# EAGLE schematic whoop-v0.11td (EAGLE 6.4)
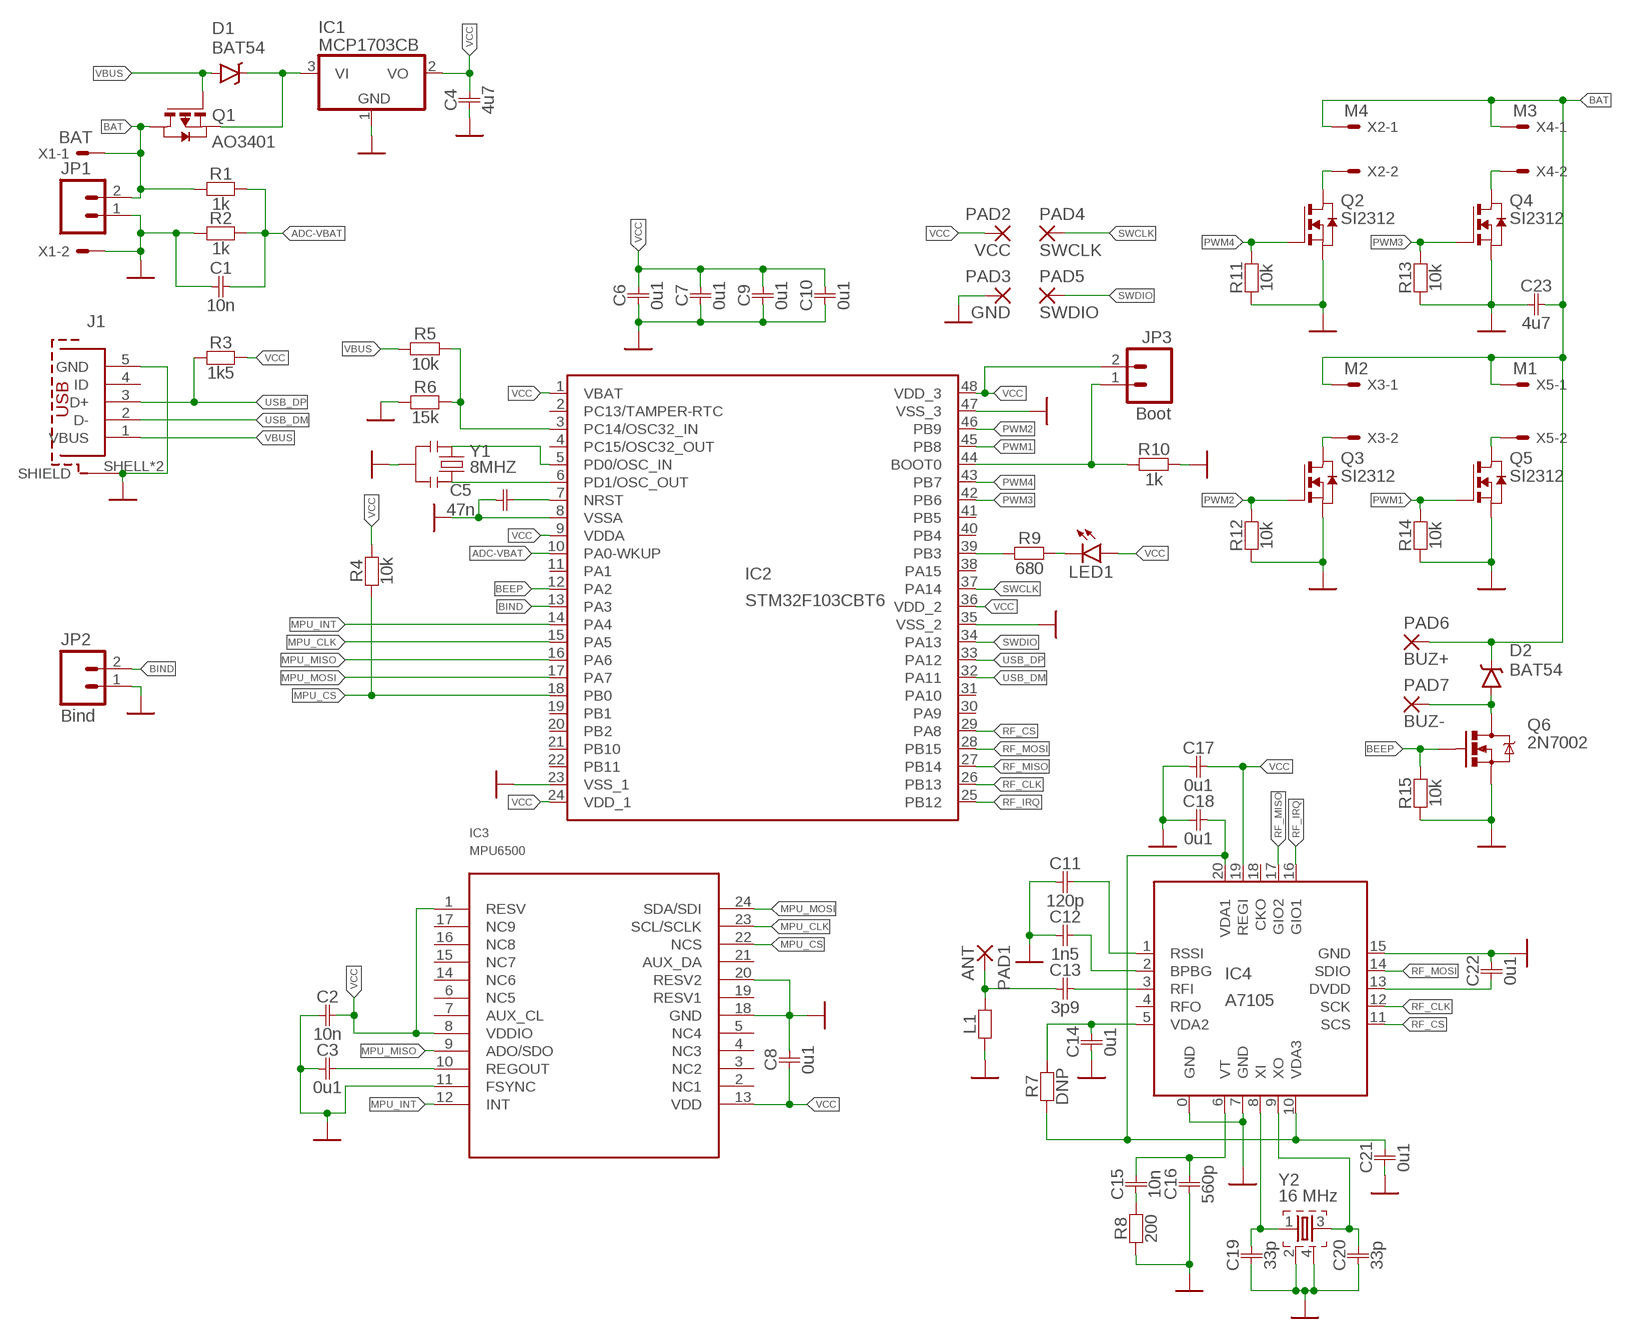
[diagram p0: schematic, sheet 1]

## Parts
C1  10n  C0402  [0402]
C2  10n  C0402  [0402]
C3  0u1  C0402  [0402]
C4  4u7  C0805  [0805]
C5  47n  C0402  [0402]
C6  0u1  C0402  [0402]
C7  0u1  C0402  [0402]
C8  0u1  C0402  [0402]
C9  0u1  C0402  [0402]
C10  0u1  C0402  [0402]
C11  120p  C0402  [0402]
C12  1n5  C0402  [0402]
C13  3p9  C0402  [0402]
C14  0u1  C0402  [0402]
C15  10n  C0402  [0402]
C16  560p  C0402  [0402]
C17  0u1  C0402  [0402]
C18  0u1  C0402  [0402]
C19  33p  C0402  [0402]
C20  33p  C0402  [0402]
C21  0u1  C0402  [0402]
C22  0u1  C0402  [0402]
C23  4u7  C0805  [0805]
D1  BAT54  BAT20JFILM  [SOD-323]
D2  BAT54  BAT20JFILM  [SOD-323]
IC1  MCP1703CB  [SOT23]
IC2  STM32F103CBT6  STM32F103C8  [LQFP48]
IC3  MPU6500  MPU-9250  [LEAD-QFN24]
IC4  A7105  [QFN20]
J1  614105150721  [614105150721]
JP1  M022MM  [1X02_2MM]
JP2  Bind  M021.27MM  [1X02_1.27MM]
JP3  Boot  M021.27MM  [1X02_1.27MM]
L1  R0402  [0402]
LED1  LED-RED0603  [LED-0603]
PAD1  ANT  1,6/0,8  [1,6/0,8]
PAD2  VCC  SMD2  [SMD1,27-2,54]
PAD3  GND  SMD2  [SMD1,27-2,54]
PAD4  SWCLK  SMD2  [SMD1,27-2,54]
PAD5  SWDIO  SMD2  [SMD1,27-2,54]
PAD6  BUZ+  SMD2  [SMD1,27-2,54]
PAD7  BUZ-  SMD2  [SMD1,27-2,54]
Q1  AO3401  PMOSSOT23  [SOT-23]
Q2  SI2312  NMOSSOT23  [SOT-23]
Q3  SI2312  NMOSSOT23  [SOT-23]
Q4  SI2312  NMOSSOT23  [SOT-23]
Q5  SI2312  NMOSSOT23  [SOT-23]
Q6  2N7002  MOSFET-NCHANNEL2N7002PW  [SOT323]
R1  1k  R0402  [0402]
R2  1k  R0402  [0402]
R3  1k5  R0402  [0402]
R4  10k  R0402  [0402]
R5  10k  R0402  [0402]
R6  15k  R0402  [0402]
R7  DNP  R0402  [0402]
R8  200  R0402  [0402]
R9  680  R0402  [0402]
R10  1k  R0402  [0402]
R11  10k  R0402  [0402]
R12  10k  R0402  [0402]
R13  10k  R0402  [0402]
R14  10k  R0402  [0402]
R15  10k  R0402  [0402]
X1  BAT  53047-02  [53047-02]
X2  M4  53047-02  [53047-02]
X3  M2  53047-02  [53047-02]
X4  M3  53047-02  [53047-02]
X5  M1  53047-02  [53047-02]
Y1  8MHZ  RESONATOR8MHZ  [RESONATOR-SMD]
Y2  16 MHz  FA-3225  [FA-20H]

## Nets
ADC-VBAT: C1.P$2 IC2.10(PA0-WKUP) R1.P$1 R2.P$1
BAT: C23.P$2 D2.C JP1.2 PAD6.1(P) Q1.1(D) R1.P$2 X1.1 X2.1 X3.1 X4.1 X5.1
BEEP: IC2.12(PA2) Q6.1(G) R15.P$2
BIND: IC2.13(PA3) JP2.2
GND: C1.P$1 C2.P$1 C3.P$1 C4.P$1 C5.P$1 C6.P$1 C7.P$1 C8.P$2 C9.P$1 C10.P$1 C11.P$1 C12.P$1 C14.P$1 C16.P$1 C17.P$1 C18.P$1 C19.P$1 C20.P$1 C21.P$1 C22.P$2 C23.P$1 IC1.1(GND) IC2.8(VSSA) IC2.23(VSS_1) IC2.35(VSS_2) IC2.47(VSS_3) IC3.11(FSYNC) IC3.18(GND) IC3.20(RESV2) IC4.0(GND) IC4.7(GND) IC4.15(GND) J1.5(GND) J1.SHELL1(SHIELD) J1.SHELL(SHIELD) JP1.1 JP2.1 L1.P$1 PAD3.1(P) Q2.2(S) Q3.2(S) Q4.2(S) Q5.2(S) Q6.2(S) R2.P$2 R6.P$2 R8.P$1 R10.P$2 R11.P$1 R12.P$1 R13.P$1 R14.P$1 R15.P$1 X1.2 Y1.2 Y2.2 Y2.4
M1+: Q2.1(D) X2.2
M2+: Q4.1(D) X4.2
M3+: Q3.1(D) X3.2
M4+: Q5.1(D) X5.2
MPU_CLK: IC2.15(PA5) IC3.23(SCL/SCLK)
MPU_CS: IC2.18(PB0) IC3.22(NCS) R4.P$1
MPU_INT: IC2.14(PA4) IC3.12(INT)
MPU_MISO: IC2.16(PA6) IC3.9(ADO/SDO)
MPU_MOSI: IC2.17(PA7) IC3.24(SDA/SDI)
N$1: C13.P$2 IC4.3(RFI)
N$2: D2.A PAD7.1(P) Q6.3(D)
N$3: C3.P$2 IC3.10(REGOUT)
N$4: C13.P$1 L1.P$2 PAD1.1(P)
N$5: C19.P$2 IC4.8(XI) Y2.1
N$6: C20.P$2 IC4.9(XO) Y2.3
N$7: C12.P$2 IC4.2(BPBG)
N$8: C11.P$2 IC4.1(RSSI)
N$9: C15.P$2 C16.P$2 IC4.6(VT)
N$10: C22.P$1 IC4.13(DVDD)
N$11: C15.P$1 R8.P$2
N$12: C18.P$2 C21.P$2 IC4.10(VDA3) IC4.20(VDA1) R7.P$1
N$13: IC2.6(PD1/OSC_OUT) Y1.3
N$14: C14.P$2 IC4.5(VDA2) R7.P$2
N$15: LED1.C R9.P$2
N$16: IC2.39(PB3) R9.P$1
N$17: IC2.3(PC14/OSC32_IN) R5.P$2 R6.P$1
N$19: IC2.44(BOOT0) JP3.1 R10.P$1
N$33: IC2.5(PD0/OSC_IN) Y1.1
N$36: D1.C IC1.3(VI) Q1.2(S)
N$37: C5.P$2 IC2.7(NRST)
PWM1: IC2.45(PB8) Q5.3(G) R14.P$2
PWM2: IC2.46(PB9) Q3.3(G) R12.P$2
PWM3: IC2.42(PB6) Q4.3(G) R13.P$2
PWM4: IC2.43(PB7) Q2.3(G) R11.P$2
RF_CLK: IC2.26(PB13) IC4.12(SCK)
RF_CS: IC2.29(PA8) IC4.11(SCS)
RF_IRQ: IC2.25(PB12) IC4.16(GIO1)
RF_MISO: IC2.27(PB14) IC4.17(GIO2)
RF_MOSI: IC2.28(PB15) IC4.14(SDIO)
SWCLK: IC2.37(PA14) PAD4.1(P)
SWDIO: IC2.34(PA13) PAD5.1(P)
USB_DM: IC2.32(PA11) J1.2(D-)
USB_DP: IC2.33(PA12) J1.3(D+) R3.P$2
VBUS: D1.A J1.1(VBUS) Q1.3(G) R5.P$1
VCC: C2.P$2 C4.P$2 C6.P$2 C7.P$2 C8.P$1 C9.P$2 C10.P$2 C17.P$2 IC1.2(VO) IC2.1(VBAT) IC2.9(VDDA) IC2.24(VDD_1) IC2.36(VDD_2) IC2.48(VDD_3) IC3.1(RESV) IC3.8(VDDIO) IC3.13(VDD) IC4.19(REGI) JP3.2 LED1.A PAD2.1(P) R3.P$1 R4.P$2
Unconnected: IC2.2(PC13/TAMPER-RTC) IC2.4(PC15/OSC32_OUT) IC2.11(PA1) IC2.19(PB1) IC2.20(PB2) IC2.21(PB10) IC2.22(PB11) IC2.30(PA9) IC2.31(PA10) IC2.38(PA15) IC2.40(PB4) IC2.41(PB5) IC3.2(NC1) IC3.3(NC2) IC3.4(NC3) IC3.5(NC4) IC3.6(NC5) IC3.7(AUX_CL) IC3.14(NC6) IC3.15(NC7) IC3.16(NC8) IC3.17(NC9) IC3.19(RESV1) IC3.21(AUX_DA) IC4.4(RFO) IC4.18(CKO) J1.4(ID)

## Library data of the parts
C1-C23 = RC.v2:C
D1 D2 = SparkFun-DiscreteSemi:BAT20JFILM: 23V, 1A Schottky diode, SOD-323 package; PROD_ID: DIO-11623; VALUE: BAT20JFILM
IC1 = semi:MCP1703: 250 mA, 16V, Low Quiescent Current LDO Regulator Source: http://ww1.microchip.com/downloads/en/DeviceDoc/22049b.pdf
IC2 = cc3d:STM32F103C8: STM32F103C8 edit this description Auto generated by make-symbol-device-package-bsdl.ulp Rev. 43 Source: STM32F103C8.txt
IC3 = invensense:MPU-9250
IC4 = A7105:A7105
J1 = micro-usb:614105150721: WR-COM_USB_Micro Type B_Vertical_THT; Micro Type B Vertical THT- Tape & Reel not for Pick & Place machine Code : Con_I-O_COM_USB_2.0_B_614105150721_614105150721 <http://katalog.we-online.de/media/images/eican/Con_I-O_COM_USB_2.0_B_614105150721_pf2.jpg> Details see: http://katalog.we-online.de/em/datasheet/614105150721.pdf Created 12/08/2014, Dan Xu 2014 (C) Wurth Elektronik
JP1-JP3 = conn:M02: Standard 2-pin 0.1" header. Use with - straight break away headers ( PRT-00116) - right angle break away headers (PRT-00553) - swiss pins (PRT-00743) - machine pins (PRT-00117) - female headers (PRT-00115) Molex polarized connector foot print use with: PRT-08233 with associated crimp pins and housings. 2.54_SCREWTERM for use with PRT-10571. 3.5mm Screw Terminal footprints for PRT-08084 5mm Screw Terminal footprints for use with PRT-08432
L1 R1-R15 = RC.v2:R
LED1 = led:LED-RED: Assorted Red LEDs LilyPad 1206- DIO-09912 1206- DIO-00809 0603- DIO-00819; PROD_ID: DIO-00819; VALUE: RED
PAD1 = wirepad:1,6/0,8: THROUGH-HOLE PAD
PAD2-PAD7 = pad:SMD2: SMD PAD
Q1 = cc3d:PMOSSOT23: MOS FET; OC_FARNELL: unknown; OC_NEWARK: unknown
Q2-Q5 = cc3d:NMOSSOT23: MOS FET; OC_FARNELL: unknown; OC_NEWARK: unknown
Q6 = SparkFun-DiscreteSemi:MOSFET-NCHANNEL: Common NMOSFET Parts MFG P/N Store ID Prod ID FDD8780 TRANS-09984 SI7820DN TRANS-11055 FDS6630A IC-08089 2N7002PW TRANS-11151 FQP30N06L COM-10213 TRANS-10060 BSS123LT1G TRANS-08345 BSS138 TRANS-00830 BS170 2N7000; PROD_ID: TRANS-11151
X1-X5 = con-molex:53?-02: CONNECTOR wire to board 1.25 mm (.049 inch) pitch header; MF: MOLEX; MPN: 53047-0210; OC_FARNELL: 9733051; OC_NEWARK: 57H4701
Y1 = resonator:RESONATOR: Resonator Small SMD resonator. Used, eg, on the Arduino Pro/ Pro Mini boards. 8MHz- XTAL-08895 16MHz- XTAL-08900; PROD_ID: XTAL-08895
Y2 = thermo:FA-: MHz RANGE CRYSTAL UNIT Source: Epson Toyocom